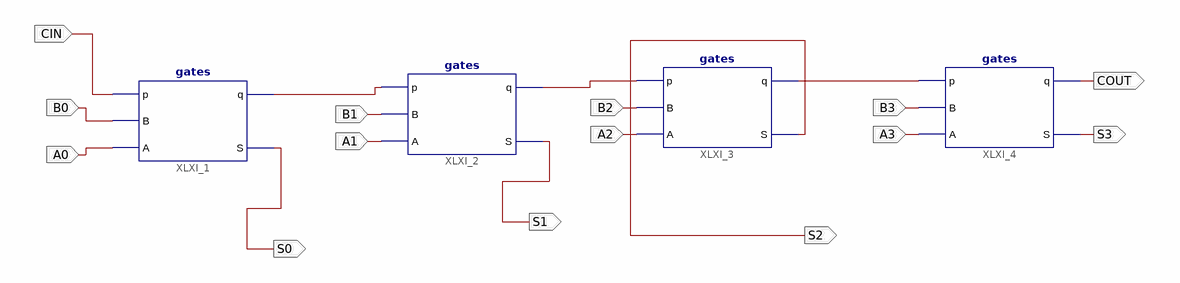
[diagram p0: schematic sheet 1]
// Xilinx ISE schematic scit4.sch (spartan3e) as structural Verilog: 4 symbols, 14 ports
module scit4 (
  input  CIN,
  input  B0,
  input  A0,
  input  B1,
  input  A1,
  input  B2,
  input  A2,
  input  B3,
  input  A3,
  output S0,
  output S1,
  output S2,
  output COUT,
  output S3
);

  wire XLXN_1, XLXN_2, XLXN_3;

  gates XLXI_1 (.p(CIN), .B(B0), .A(A0), .q(XLXN_3), .S(S0));
  gates XLXI_2 (.p(XLXN_3), .B(B1), .A(A1), .q(XLXN_2), .S(S1));
  gates XLXI_3 (.p(XLXN_2), .B(B2), .A(A2), .q(XLXN_1), .S(S2));
  gates XLXI_4 (.p(XLXN_1), .B(B3), .A(A3), .q(COUT), .S(S3));
endmodule
